# Altium schematic sheet MCU.SchDoc
size A3
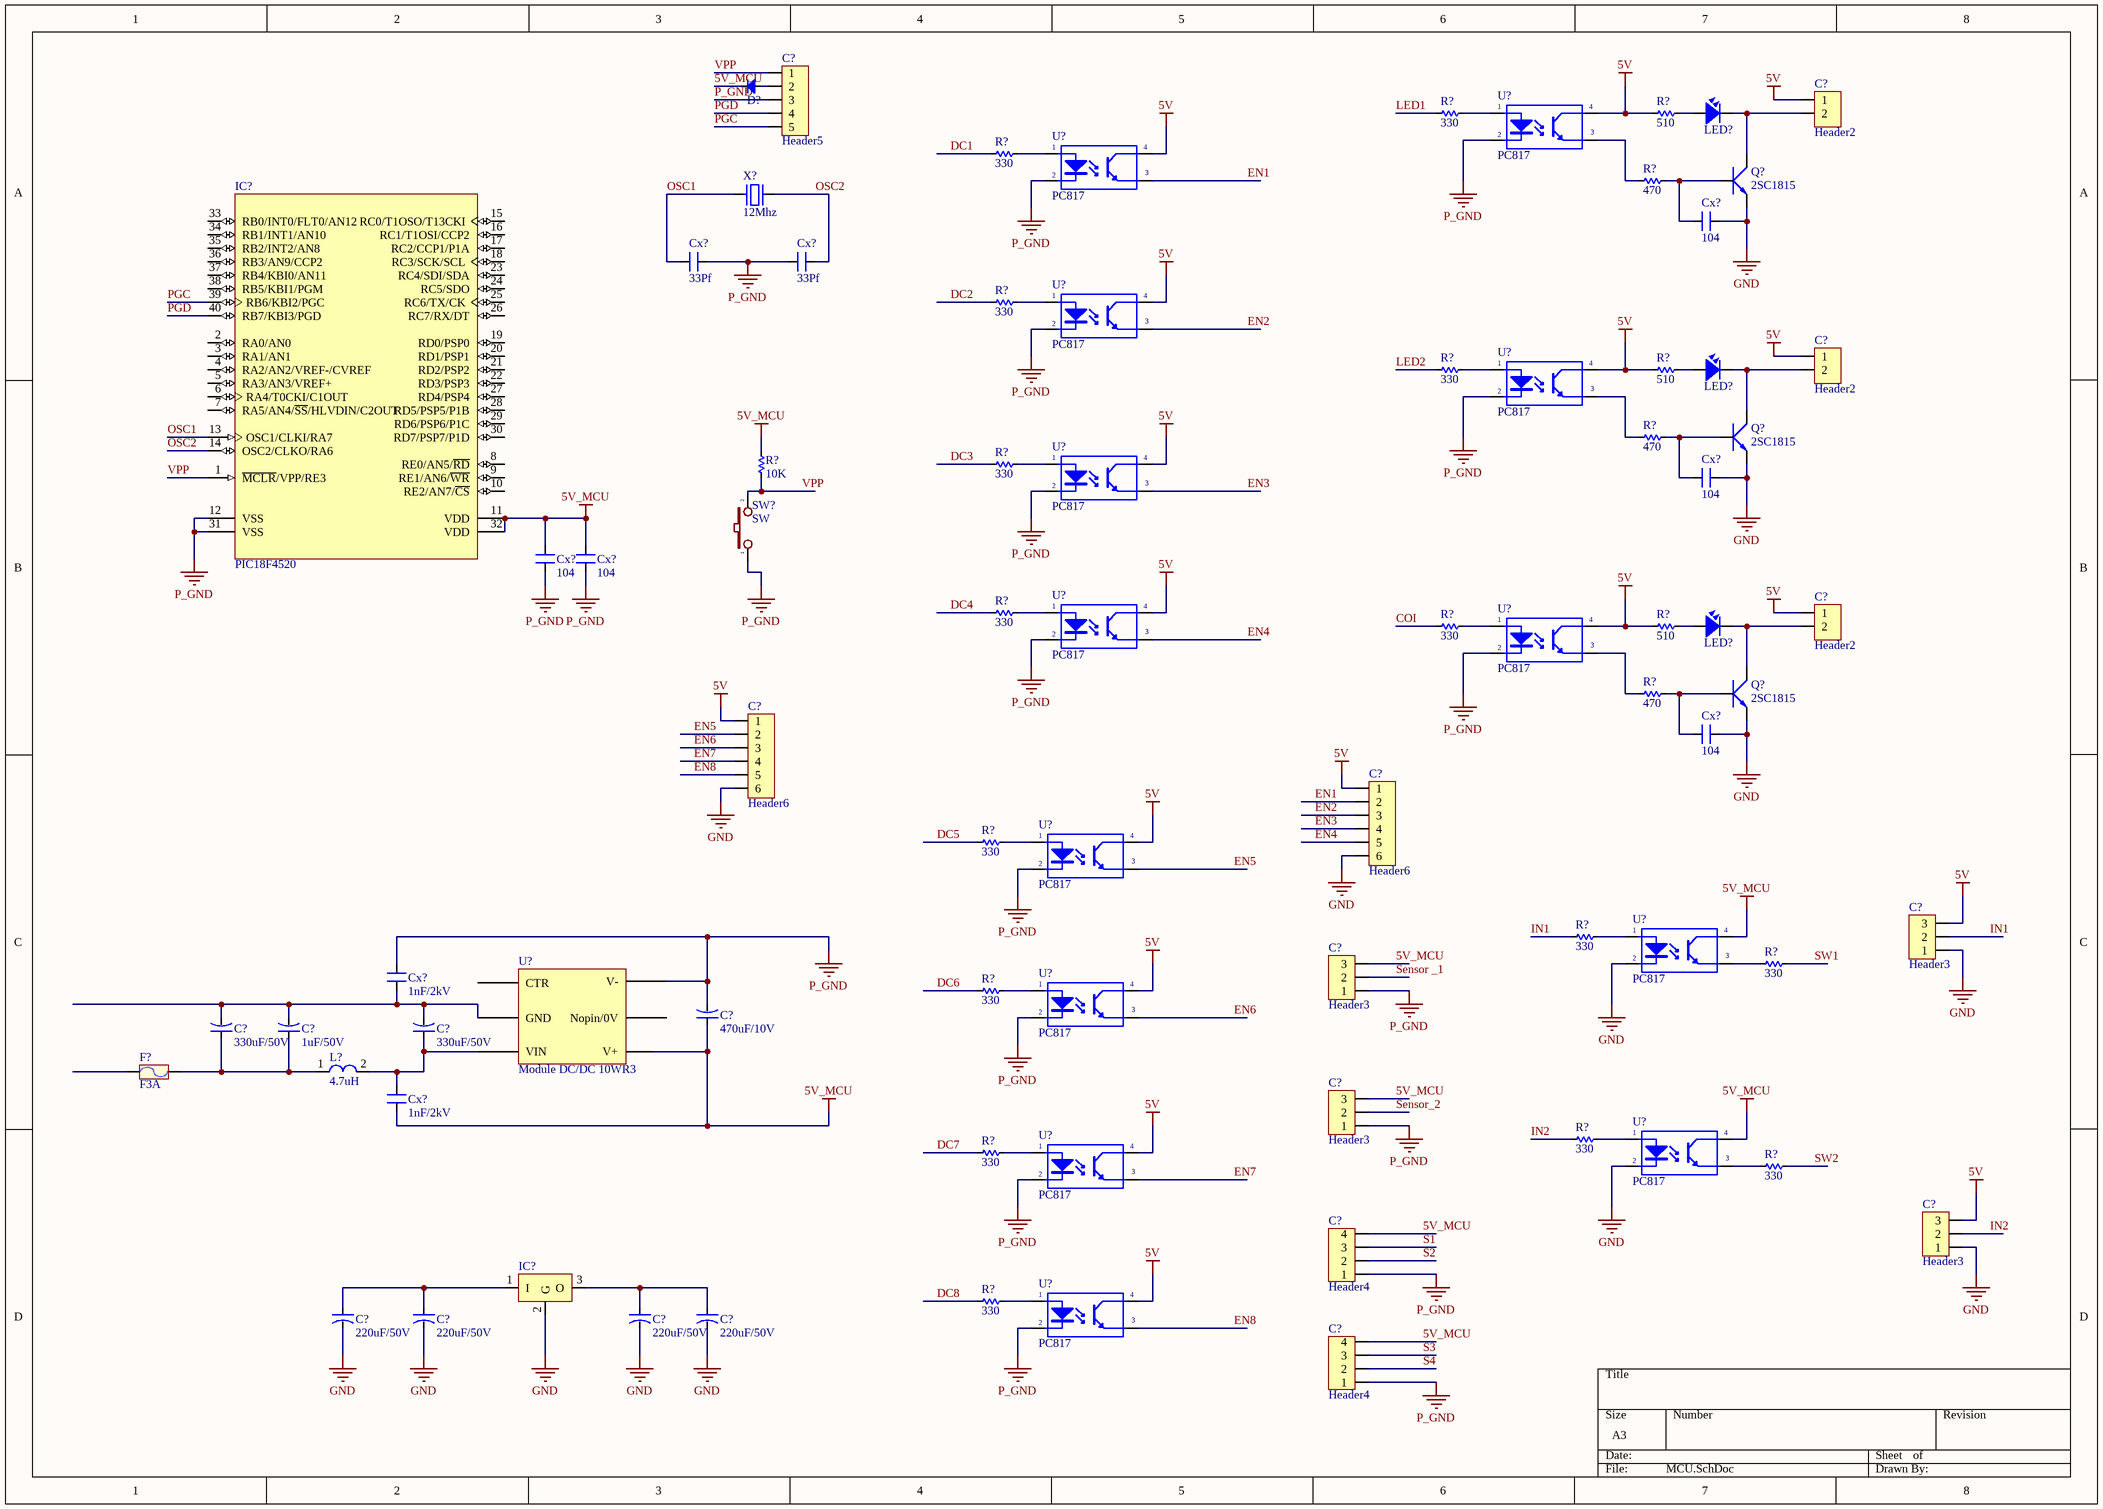
[diagram p0: MCU.SchDoc]

## Parts
(Parts that share a designator on the sheet are numbered #1, #2 ... from top to bottom, then left to right.)
C?#1  Header5  [HDR5]
C?#2  Header2  [Header2]
C?#3  Header2  [Header2]
C?#4  Header2  [Header2]
C?#5  Header6  [HDR6]
C?#6  Header6  [HDR6]
C?#7  Header3  [Header3]
C?#8  Header3  [HDR3]
C?#9  470uF/10V  [TANTALUM-7343]
C?#10  330uF/50V  [CAP-ALU-SMD-G]
C?#11  1uF/50V  [CAP-ALU-SMD-4.5x5x1.4]
C?#12  330uF/50V  [CAP-ALU-SMD-G]
C?#13  Header3  [HDR3]
C?#14  Header3  [Header3]
C?#15  Header4  [Header4]
C?#16  220uF/50V  [CAP-ALU-SMD-6.3x7.7x2.2]
C?#17  220uF/50V  [CAP-ALU-SMD-6.3x7.7x2.2]
C?#18  220uF/50V  [CAP-ALU-SMD-6.3x7.7x2.2]
C?#19  220uF/50V  [CAP-ALU-SMD-6.3x7.7x2.2]
C?#20  Header4  [Header4]
Cx?#1  104  [CN-SMD-0805]
Cx?#2  33Pf  [CN-SMD-0805]
Cx?#3  33Pf  [CN-SMD-0805]
Cx?#4  104  [CN-SMD-0805]
Cx?#5  104  [CN-SMD-0805]
Cx?#6  104  [CN-SMD-0805]
Cx?#7  104  [CN-SMD-0805]
Cx?#8  1nF/2kV  [CN2-B]
Cx?#9  1nF/2kV  [CN2-B]
D?  Diode  [DIO-1A]  (value not drawn)
F?  F3A  [FUSE_SMD 1812]
IC?#1  PIC18F4520  [DIP40/W0.6]
IC?#2  LM78xx  [TO252-123]  (value not drawn)
L?  4.7uH  [L-SMD-M-12x10]
LED?#1  LED  [LED-0805-Red]  (value not drawn)
LED?#2  LED  [LED-0805-Red]  (value not drawn)
LED?#3  LED  [LED-0805-Red]  (value not drawn)
Q?#1  2SC1815  [SOT23-321]
Q?#2  2SC1815  [SOT23-321]
Q?#3  2SC1815  [SOT23-321]
R?#1  330  [RES-SMD-0805]
R?#2  510  [RES-SMD-0805]
R?#3  330  [RES-SMD-0805]
R?#4  470  [RES-SMD-0805]
R?#5  330  [RES-SMD-0805]
R?#6  330  [RES-SMD-0805]
R?#7  510  [RES-SMD-0805]
R?#8  470  [RES-SMD-0805]
R?#9  10K  [RES-SMD-0805]
R?#10  330  [RES-SMD-0805]
R?#11  330  [RES-SMD-0805]
R?#12  330  [RES-SMD-0805]
R?#13  510  [RES-SMD-0805]
R?#14  470  [RES-SMD-0805]
R?#15  330  [RES-SMD-0805]
R?#16  330  [RES-SMD-0805]
R?#17  330  [RES-SMD-0805]
R?#18  330  [RES-SMD-0805]
R?#19  330  [RES-SMD-0805]
R?#20  330  [RES-SMD-0805]
R?#21  330  [RES-SMD-0805]
R?#22  330  [RES-SMD-0805]
SW?  SW  [SW1-SMD]
U?#1  PC817  [SO4]
U?#2  PC817  [SO4]
U?#3  PC817  [SO4]
U?#4  PC817  [SO4]
U?#5  PC817  [SO4]
U?#6  PC817  [SO4]
U?#7  PC817  [SO4]
U?#8  PC817  [SO4]
U?#9  PC817  [SO4]
U?#10  PC817  [SO4]
U?#11  Module DC/DC 10WR3  [Module DC DC 10W/R3]
U?#12  PC817  [SO4]
U?#13  PC817  [SO4]
U?#14  PC817  [SO4]
X?  12Mhz  [XTAL-RU49/4]

## Nets
5V: C?#2.1 C?#3.1 C?#4.1 C?#5.1 C?#6.1 C?#7.3 C?#14.3 R?#2.2 R?#7.2 R?#13.2 U?#1.4(C) U?#2.4(C) U?#3.4(C) U?#4.4(C) U?#5.4(C) U?#6.4(C) U?#7.4(C) U?#8.4(C) U?#10.4(C) U?#13.4(C) U?#14.4(C)
5V_MCU: C?#8.3 C?#9.1 C?#13.3 C?#15.4 C?#20.4 Cx?#5.2 Cx?#6.2 Cx?#9.1 D?.2(K) IC?#1.11(VDD) IC?#1.32(VDD) R?#9.1 U?#9.4(C) U?#11.V+ U?#12.4(C)
GND: C?#5.6 C?#6.6 C?#7.1 C?#14.1 C?#16.2 C?#17.2 C?#18.2 C?#19.2 Cx?#1.1 Cx?#4.1 Cx?#7.1 IC?#2.2(G) Q?#1.1(E) Q?#2.1(E) Q?#3.1(E) U?#9.2(K) U?#12.2(K)
P_GND: C?#1.3 C?#8.1 C?#9.2 C?#13.1 C?#15.1 C?#20.1 Cx?#2.2 Cx?#3.1 Cx?#5.1 Cx?#6.1 Cx?#8.2 IC?#1.12(VSS) IC?#1.31(VSS) SW?.1 U?#1.2(K) U?#2.2(K) U?#3.2(K) U?#4.2(K) U?#5.2(K) U?#6.2(K) U?#7.2(K) U?#8.2(K) U?#10.2(K) U?#11.V- U?#13.2(K) U?#14.2(K)
COI: R?#12.2
DC1: R?#3.2
DC2: R?#5.2
DC3: R?#10.2
DC4: R?#11.2
DC5: R?#15.2
DC6: R?#18.2
DC7: R?#20.2
DC8: R?#22.2
EN1: C?#6.2 U?#2.3(E)
EN2: C?#6.3 U?#3.3(E)
EN3: C?#6.4 U?#5.3(E)
EN4: C?#6.5 U?#6.3(E)
EN5: C?#5.2 U?#8.3(E)
EN6: C?#5.3 U?#10.3(E)
EN7: C?#5.4 U?#13.3(E)
EN8: C?#5.5 U?#14.3(E)
IN1: C?#7.2 R?#16.2
IN2: C?#14.2 R?#19.2
LED1: R?#1.2
LED2: R?#6.2
OSC1: Cx?#2.1 IC?#1.13(OSC1/CLKI/RA7) X?.1
OSC2: Cx?#3.2 IC?#1.14(OSC2/CLKO/RA6) X?.2
PGC: C?#1.5 IC?#1.39(RB6/KBI2/PGC)
PGD: C?#1.4 IC?#1.40(RB7/KBI3/PGD)
S1: C?#15.3
S2: C?#15.2
S3: C?#20.3
S4: C?#20.2
Sensor _1: C?#8.2
Sensor_2: C?#13.2
SW1: R?#17.1
SW2: R?#21.1
VPP: C?#1.1 IC?#1.1(~{MCLR}/VPP/RE3) R?#9.2 SW?.2
NetC?#1_2: C?#1.2 D?.1(A)
NetC?#2_2: C?#2.2 LED?#1.2 Q?#1.2(C)
NetC?#3_2: C?#3.2 LED?#2.2 Q?#2.2(C)
NetC?#4_2: C?#4.2 LED?#3.2 Q?#3.2(C)
NetC?#10_1: C?#10.1 C?#11.1 F?.2 L?.1
NetC?#10_2: C?#10.2 C?#11.2 C?#12.2 Cx?#8.1 U?#11.GND
NetC?#12_1: C?#12.1 Cx?#9.2 L?.2 U?#11.VIN
NetC?#16_1: C?#16.1 C?#17.1 IC?#2.1(I)
NetC?#18_1: C?#18.1 C?#19.1 IC?#2.3(O)
NetCx?#1_2: Cx?#1.2 Q?#1.3(B) R?#4.1
NetCx?#4_2: Cx?#4.2 Q?#2.3(B) R?#8.1
NetCx?#7_2: Cx?#7.2 Q?#3.3(B) R?#14.1
NetLED?#1_1: LED?#1.1 R?#2.1
NetLED?#2_1: LED?#2.1 R?#7.1
NetLED?#3_1: LED?#3.1 R?#13.1
NetR?#1_1: R?#1.1 U?#1.1(A)
NetR?#3_1: R?#3.1 U?#2.1(A)
NetR?#4_2: R?#4.2 U?#1.3(E)
NetR?#5_1: R?#5.1 U?#3.1(A)
NetR?#6_1: R?#6.1 U?#4.1(A)
NetR?#8_2: R?#8.2 U?#4.3(E)
NetR?#10_1: R?#10.1 U?#5.1(A)
NetR?#11_1: R?#11.1 U?#6.1(A)
NetR?#12_1: R?#12.1 U?#7.1(A)
NetR?#14_2: R?#14.2 U?#7.3(E)
NetR?#15_1: R?#15.1 U?#8.1(A)
NetR?#16_1: R?#16.1 U?#9.1(A)
NetR?#17_2: R?#17.2 U?#9.3(E)
NetR?#18_1: R?#18.1 U?#10.1(A)
NetR?#19_1: R?#19.1 U?#12.1(A)
NetR?#20_1: R?#20.1 U?#13.1(A)
NetR?#21_2: R?#21.2 U?#12.3(E)
NetR?#22_1: R?#22.1 U?#14.1(A)

Not connected (* = marked no-connect by the designer): F? 1; IC?#1 2(RA0/AN0) 3(RA1/AN1) 4(RA2/AN2/VREF-/CVREF) 5(RA3/AN3/VREF+) 6(RA4/T0CKI/C1OUT) 7(RA5/AN4/~{SS}/HLVDIN/C2OUT) 8(RE0/AN5/~{RD}) 9(RE1/AN6/~{WR}) 10(RE2/AN7/~{CS}) 15(RC0/T1OSO/T13CKI) 16(RC1/T1OSI/CCP2) 17(RC2/CCP1/P1A) 18(RC3/SCK/SCL) 19(RD0/PSP0) 20(RD1/PSP1) 21(RD2/PSP2) 22(RD3/PSP3) 23(RC4/SDI/SDA) 24(RC5/SDO) 25(RC6/TX/CK) 26(RC7/RX/DT) 27(RD4/PSP4) 28(RD5/PSP5/P1B) 29(RD6/PSP6/P1C) 30(RD7/PSP7/P1D) 33(RB0/INT0/FLT0/AN12) 34(RB1/INT1/AN10) 35(RB2/INT2/AN8) 36(RB3/AN9/CCP2) 37(RB4/KBI0/AN11) 38(RB5/KBI1/PGM); U?#11 CTR Nopin/0V

## Library data of the parts
C?#1 = Header5: Header IDC, 5 x 1 Pin Vertical 2.54mm Pitch (Non-Boxed, Male); Manufacturer: W¨¹rth Elektronik eiSos GmbH; partNo: 613002143121; ComponentLink1 Description: Manufacturer; ComponentLink2 Description: Datasheet; NoPins: 02; Created Date: 29 March 2013; ComponentLink1URL: http://www.we-online.com; ComponentLink2URL: http://katalog.we-online.de/em/datasheet/6130xx143121.pdf; Created by: Karrer Zheng
C?#2-C?#4 = Header2: Header IDC, 2 x 1 Pin Vertical 2.54mm Pitch (Non-Boxed, Male); Manufacturer: W¨¹rth Elektronik eiSos GmbH; partNo: 613002143121; ComponentLink1 Description: Manufacturer; ComponentLink2 Description: Datasheet; NoPins: 02; Created Date: 29 March 2013; ComponentLink1URL: http://www.we-online.com; ComponentLink2URL: http://katalog.we-online.de/em/datasheet/6130xx143121.pdf; Created by: Karrer Zheng
C?#5 C?#6 = Header6: Header IDC, 6 x 1 Pin Vertical 2.54mm Pitch (Non-Boxed, Male); Manufacturer: W¨¹rth Elektronik eiSos GmbH; partNo: 613002143121; ComponentLink1 Description: Manufacturer; ComponentLink2 Description: Datasheet; NoPins: 02; Created Date: 29 March 2013; ComponentLink1URL: http://www.we-online.com; ComponentLink2URL: http://katalog.we-online.de/em/datasheet/6130xx143121.pdf; Created by: Karrer Zheng
C?#7 C?#8 C?#13 C?#14 = Header3: Header IDC, 3 x 1 Pin Vertical 2.54mm Pitch (Non-Boxed, Male); Manufacturer: W¨¹rth Elektronik eiSos GmbH; partNo: 613002143121; ComponentLink1 Description: Manufacturer; ComponentLink2 Description: Datasheet; NoPins: 02; Created Date: 29 March 2013; ComponentLink1URL: http://www.we-online.com; ComponentLink2URL: http://katalog.we-online.de/em/datasheet/6130xx143121.pdf; Created by: Karrer Zheng
C?#9 = CN-TANTALUM-SMD
C?#10-C?#12 C?#16-C?#19 = CN-ALU-SMD: Polarized Capacitor (Axial); Published: 8-Jun-2000; LatestRevisionDate: 17-Jul-2002; LatestRevisionNote: Re-released for DXP Platform.; PackageReference: POLAR0.8; Publisher: Altium Limited
C?#15 C?#20 = Header4: Header IDC, 4 x 1 Pin Vertical 2.54mm Pitch (Non-Boxed, Male); Manufacturer: W¨¹rth Elektronik eiSos GmbH; partNo: 613002143121; ComponentLink1 Description: Manufacturer; ComponentLink2 Description: Datasheet; NoPins: 02; Created Date: 29 March 2013; ComponentLink1URL: http://www.we-online.com; ComponentLink2URL: http://katalog.we-online.de/em/datasheet/6130xx143121.pdf; Created by: Karrer Zheng
Cx?#1 Cx?#4-Cx?#9 = CN: Value: 33pF
Cx?#2 Cx?#3 = CN: Value: 33pF
D? = Diode: Default Diode; Code - JEDEC: DO-214-AB; Value: 1N5007; Published: 8-Jun-2000; Revision: July-2002: Re-released for DXP Platform.; Publisher: Altium Limited
F? = Fuse: Designed by: VanDungEvn; Value: Fuse
IC?#1 = PIC18F4520: 32KB Flash, 1536B RAM, 256B EFROM, 40-Pin PDIP; Value: DIP 40; Value: 18F4520; Copyright by: VanDungEvn
IC?#2 = LM78xx: Positive Voltage Regulator; Note: Tab is connected to pin 3 (GND).; Published: 24-Aug-2001; LatestRevisionDate: 17-Jul-2002; LatestRevisionNote: Re-released for DXP Platform.; DatasheetVersion: Apr-1994; PackageVersion: Jul-1998; PackageReference: ISOWATT220AB; Publisher: Altium Limited; PackageDescription: TO, Thru-Hole, Vertical, Heatsink Mounted; 3 In-Line Leads; Pitch 2.54 mm; Pin sequence 1, 3, 2; ComponentLink1Description: Manufacturer Link; ComponentLink1URL: http://www.st.com/; ComponentLink2Description: Datasheet; ComponentLink2URL: http://www.st.com/stonline/products/literature/ds/2146/l78m05c.pdf
L? = L-SMD-1: partNo: 78477010; Manufacturer: Wurth Elektronik; Inductance: 1.0 μH; ComponentLink1Description: Manufacturer; ComponentLink1URL: http://www.we-online.de; Created by: Baojun Chen; Created Date: Nov.2015; ComponentLink2Description: Datasheet; ComponentLink2URL: http://katalog.we-online.de/pbs/datasheet/78477010.pdf
LED?#1-LED?#3 = LED SMD: Value: LED 3 - 5 ly 2 Colour
Q?#1-Q?#3 = 2SC1815: NPN 600mW, ECB; Value: C1815
R?#1-R?#22 = Res-SMD: Resistor; Manufacturer: Generic Components; Class: Passive; Published: 08/06/2000; Publisher: Altium Hobart Technology Centre
SW? = SW2: Switch button 2 pin; Value: SW chip 2 pin
U?#1-U?#10 U?#12-U?#14 = PC817: Single Opto; Value: PC817
X? = XT2: Crystal, 32.768 KHz, -40 to 85 degC, 3.2 x 1.5 x 0.9 mm SMD; Value: 4Mhz